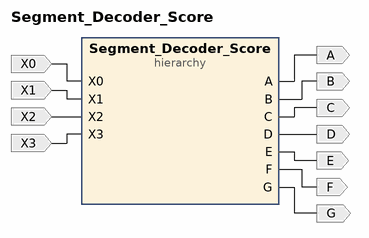
[diagram p0: block diagram of the top level]
# Vivado block design Segment_Decoder_Score, xc7a35tcpg236-1, Vivado 2018.3
create_bd_design Segment_Decoder_Score

create_bd_port -dir I X0
create_bd_port -dir I X1
create_bd_port -dir I X2
create_bd_port -dir I X3
create_bd_port -dir O A
create_bd_port -dir O B
create_bd_port -dir O C
create_bd_port -dir O D
create_bd_port -dir O E
create_bd_port -dir O F
create_bd_port -dir O G

create_bd_cell -type hier Segment_Decoder_Score

# ---- hierarchy /Segment_Decoder_Score ----
current_bd_instance /Segment_Decoder_Score
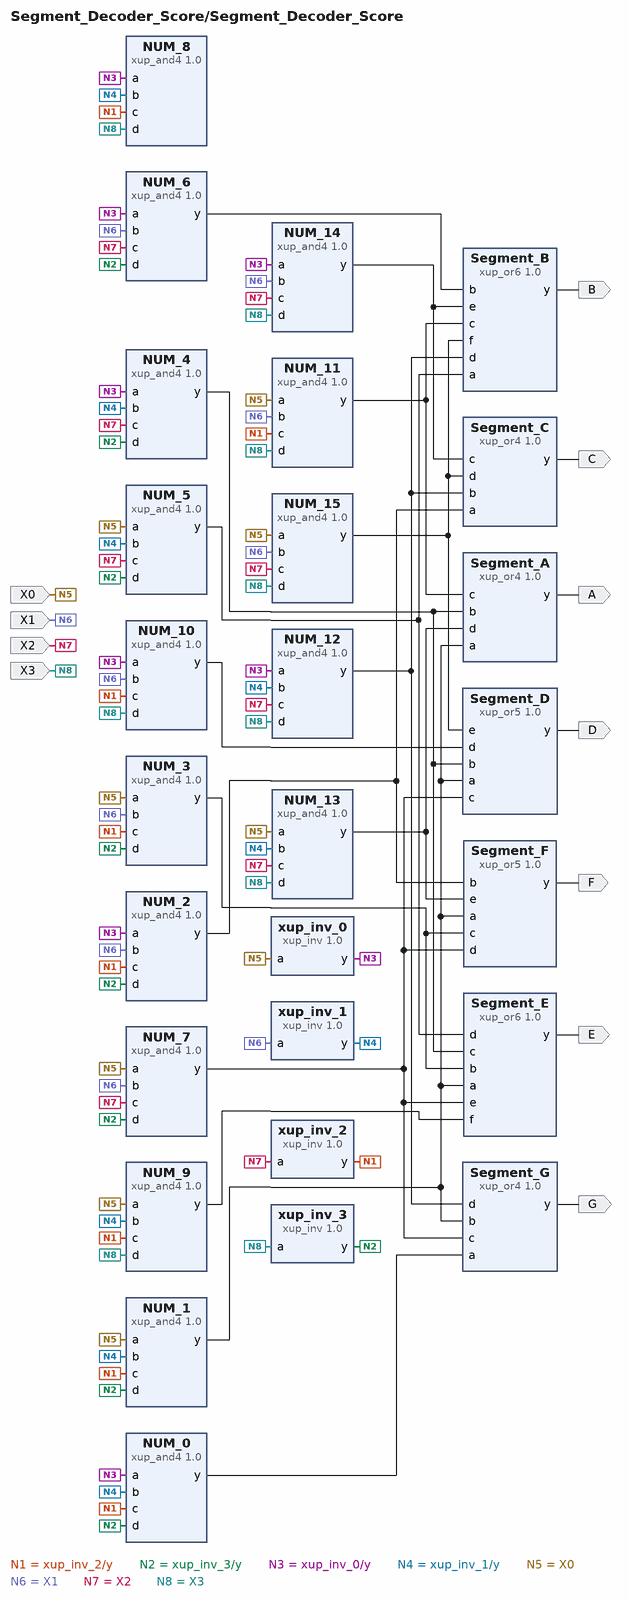
[diagram p1: block diagram inside /Segment_Decoder_Score]
create_bd_pin -dir I X0
create_bd_pin -dir I X1
create_bd_pin -dir I X2
create_bd_pin -dir I X3
create_bd_pin -dir O A
create_bd_pin -dir O B
create_bd_pin -dir O C
create_bd_pin -dir O D
create_bd_pin -dir O E
create_bd_pin -dir O F
create_bd_pin -dir O G

create_bd_cell -type ip -vlnv xilinx.com:xup:xup_and4:1.0 NUM_3
set_property -dict {CONFIG.DELAY 0} [get_bd_cells NUM_3]
create_bd_cell -type ip -vlnv xilinx.com:xup:xup_and4:1.0 NUM_4
set_property -dict {CONFIG.DELAY 0} [get_bd_cells NUM_4]
create_bd_cell -type ip -vlnv xilinx.com:xup:xup_and4:1.0 NUM_5
set_property -dict {CONFIG.DELAY 0} [get_bd_cells NUM_5]
create_bd_cell -type ip -vlnv xilinx.com:xup:xup_and4:1.0 NUM_6
set_property -dict {CONFIG.DELAY 0} [get_bd_cells NUM_6]
create_bd_cell -type ip -vlnv xilinx.com:xup:xup_and4:1.0 NUM_7
set_property -dict {CONFIG.DELAY 0} [get_bd_cells NUM_7]
create_bd_cell -type ip -vlnv xilinx.com:xup:xup_and4:1.0 NUM_10
set_property -dict {CONFIG.DELAY 0} [get_bd_cells NUM_10]
create_bd_cell -type ip -vlnv xilinx.com:xup:xup_and4:1.0 NUM_8
set_property -dict {CONFIG.DELAY 0} [get_bd_cells NUM_8]
create_bd_cell -type ip -vlnv xilinx.com:xup:xup_and4:1.0 NUM_11
set_property -dict {CONFIG.DELAY 0} [get_bd_cells NUM_11]
create_bd_cell -type ip -vlnv xilinx.com:xup:xup_and4:1.0 NUM_9
set_property -dict {CONFIG.DELAY 0} [get_bd_cells NUM_9]
create_bd_cell -type ip -vlnv xilinx.com:xup:xup_and4:1.0 NUM_12
set_property -dict {CONFIG.DELAY 0} [get_bd_cells NUM_12]
create_bd_cell -type ip -vlnv xilinx.com:xup:xup_inv:1.0 xup_inv_0
set_property -dict {CONFIG.DELAY 0} [get_bd_cells xup_inv_0]
create_bd_cell -type ip -vlnv xilinx.com:xup:xup_or4:1.0 Segment_A
set_property -dict {CONFIG.DELAY 0} [get_bd_cells Segment_A]
create_bd_cell -type ip -vlnv xilinx.com:xup:xup_and4:1.0 NUM_13
set_property -dict {CONFIG.DELAY 0} [get_bd_cells NUM_13]
create_bd_cell -type ip -vlnv xilinx.com:xup:xup_inv:1.0 xup_inv_1
set_property -dict {CONFIG.DELAY 0} [get_bd_cells xup_inv_1]
create_bd_cell -type ip -vlnv xilinx.com:xup:xup_or6:1.0 Segment_B
set_property -dict {CONFIG.DELAY 0} [get_bd_cells Segment_B]
create_bd_cell -type ip -vlnv xilinx.com:xup:xup_and4:1.0 NUM_14
set_property -dict {CONFIG.DELAY 0} [get_bd_cells NUM_14]
create_bd_cell -type ip -vlnv xilinx.com:xup:xup_inv:1.0 xup_inv_2
set_property -dict {CONFIG.DELAY 0} [get_bd_cells xup_inv_2]
create_bd_cell -type ip -vlnv xilinx.com:xup:xup_or4:1.0 Segment_C
set_property -dict {CONFIG.DELAY 0} [get_bd_cells Segment_C]
create_bd_cell -type ip -vlnv xilinx.com:xup:xup_and4:1.0 NUM_15
set_property -dict {CONFIG.DELAY 0} [get_bd_cells NUM_15]
create_bd_cell -type ip -vlnv xilinx.com:xup:xup_inv:1.0 xup_inv_3
set_property -dict {CONFIG.DELAY 0} [get_bd_cells xup_inv_3]
create_bd_cell -type ip -vlnv xilinx.com:xup:xup_or5:1.0 Segment_D
set_property -dict {CONFIG.DELAY 0} [get_bd_cells Segment_D]
create_bd_cell -type ip -vlnv xilinx.com:xup:xup_and4:1.0 NUM_0
set_property -dict {CONFIG.DELAY 0} [get_bd_cells NUM_0]
create_bd_cell -type ip -vlnv xilinx.com:xup:xup_or6:1.0 Segment_E
set_property -dict {CONFIG.DELAY 0} [get_bd_cells Segment_E]
create_bd_cell -type ip -vlnv xilinx.com:xup:xup_or5:1.0 Segment_F
set_property -dict {CONFIG.DELAY 0} [get_bd_cells Segment_F]
create_bd_cell -type ip -vlnv xilinx.com:xup:xup_and4:1.0 NUM_1
set_property -dict {CONFIG.DELAY 0} [get_bd_cells NUM_1]
create_bd_cell -type ip -vlnv xilinx.com:xup:xup_or4:1.0 Segment_G
set_property -dict {CONFIG.DELAY 0} [get_bd_cells Segment_G]
create_bd_cell -type ip -vlnv xilinx.com:xup:xup_and4:1.0 NUM_2
set_property -dict {CONFIG.DELAY 0} [get_bd_cells NUM_2]

# ---- connections ----

current_bd_instance /Segment_Decoder_Score
connect_bd_net [get_bd_pins xup_inv_2/y] \
  [get_bd_pins NUM_0/c] [get_bd_pins NUM_1/c] [get_bd_pins NUM_2/c] [get_bd_pins NUM_3/c] [get_bd_pins NUM_8/c] \
  [get_bd_pins NUM_9/c] [get_bd_pins NUM_10/c] [get_bd_pins NUM_11/c]
connect_bd_net [get_bd_pins xup_inv_3/y] \
  [get_bd_pins NUM_0/d] [get_bd_pins NUM_1/d] [get_bd_pins NUM_2/d] [get_bd_pins NUM_3/d] [get_bd_pins NUM_4/d] \
  [get_bd_pins NUM_5/d] [get_bd_pins NUM_6/d] [get_bd_pins NUM_7/d]
connect_bd_net [get_bd_pins NUM_3/y] [get_bd_pins Segment_E/b] [get_bd_pins Segment_F/c]
connect_bd_net [get_bd_pins xup_inv_0/y] \
  [get_bd_pins NUM_0/a] [get_bd_pins NUM_2/a] [get_bd_pins NUM_4/a] [get_bd_pins NUM_6/a] [get_bd_pins NUM_8/a] \
  [get_bd_pins NUM_10/a] [get_bd_pins NUM_12/a] [get_bd_pins NUM_14/a]
connect_bd_net [get_bd_pins xup_inv_1/y] \
  [get_bd_pins NUM_0/b] [get_bd_pins NUM_1/b] [get_bd_pins NUM_4/b] [get_bd_pins NUM_5/b] [get_bd_pins NUM_8/b] \
  [get_bd_pins NUM_9/b] [get_bd_pins NUM_12/b] [get_bd_pins NUM_13/b]
connect_bd_net [get_bd_pins NUM_4/y] [get_bd_pins Segment_A/b] [get_bd_pins Segment_D/b] [get_bd_pins Segment_E/c]
connect_bd_net [get_bd_pins NUM_5/y] [get_bd_pins Segment_B/a] [get_bd_pins Segment_E/d]
connect_bd_net [get_bd_pins NUM_6/y] [get_bd_pins Segment_B/b]
connect_bd_net [get_bd_pins NUM_7/y] [get_bd_pins Segment_D/c] [get_bd_pins Segment_E/e] [get_bd_pins Segment_F/d] [get_bd_pins Segment_G/c]
connect_bd_net [get_bd_pins NUM_10/y] [get_bd_pins Segment_D/d]
connect_bd_net [get_bd_pins NUM_11/y] [get_bd_pins Segment_A/c] [get_bd_pins Segment_B/c]
connect_bd_net [get_bd_pins NUM_9/y] [get_bd_pins Segment_E/f]
connect_bd_net [get_bd_pins NUM_12/y] [get_bd_pins Segment_B/d] [get_bd_pins Segment_C/b] [get_bd_pins Segment_G/d]
connect_bd_net [get_bd_pins NUM_1/y] \
  [get_bd_pins Segment_A/a] [get_bd_pins Segment_D/a] [get_bd_pins Segment_E/a] [get_bd_pins Segment_F/a] \
  [get_bd_pins Segment_G/b]
connect_bd_net [get_bd_pins NUM_13/y] [get_bd_pins Segment_A/d] [get_bd_pins Segment_F/e]
connect_bd_net [get_bd_pins NUM_14/y] [get_bd_pins Segment_B/e] [get_bd_pins Segment_C/c]
connect_bd_net [get_bd_pins NUM_15/y] [get_bd_pins Segment_B/f] [get_bd_pins Segment_C/d] [get_bd_pins Segment_D/e]
connect_bd_net [get_bd_pins NUM_2/y] [get_bd_pins Segment_C/a] [get_bd_pins Segment_F/b]
connect_bd_net [get_bd_pins NUM_0/y] [get_bd_pins Segment_G/a]
connect_bd_net -net X0_1 [get_bd_pins X0] \
  [get_bd_pins xup_inv_0/a] [get_bd_pins NUM_1/a] [get_bd_pins NUM_5/a] [get_bd_pins NUM_7/a] [get_bd_pins NUM_9/a] \
  [get_bd_pins NUM_11/a] [get_bd_pins NUM_13/a] [get_bd_pins NUM_15/a] [get_bd_pins NUM_3/a]
connect_bd_net -net X1_1 [get_bd_pins X1] \
  [get_bd_pins xup_inv_1/a] [get_bd_pins NUM_2/b] [get_bd_pins NUM_6/b] [get_bd_pins NUM_7/b] [get_bd_pins NUM_10/b] \
  [get_bd_pins NUM_11/b] [get_bd_pins NUM_14/b] [get_bd_pins NUM_15/b] [get_bd_pins NUM_3/b]
connect_bd_net -net X2_1 [get_bd_pins X2] \
  [get_bd_pins xup_inv_2/a] [get_bd_pins NUM_5/c] [get_bd_pins NUM_6/c] [get_bd_pins NUM_7/c] [get_bd_pins NUM_12/c] \
  [get_bd_pins NUM_13/c] [get_bd_pins NUM_14/c] [get_bd_pins NUM_15/c] [get_bd_pins NUM_4/c]
connect_bd_net -net X3_1 [get_bd_pins X3] \
  [get_bd_pins xup_inv_3/a] [get_bd_pins NUM_8/d] [get_bd_pins NUM_9/d] [get_bd_pins NUM_11/d] [get_bd_pins NUM_12/d] \
  [get_bd_pins NUM_13/d] [get_bd_pins NUM_14/d] [get_bd_pins NUM_15/d] [get_bd_pins NUM_10/d]
connect_bd_net -net xup_or4_0_y [get_bd_pins Segment_A/y] [get_bd_pins A]
connect_bd_net -net xup_or6_0_y [get_bd_pins Segment_B/y] [get_bd_pins B]
connect_bd_net -net xup_or4_1_y [get_bd_pins Segment_C/y] [get_bd_pins C]
connect_bd_net -net xup_or5_0_y [get_bd_pins Segment_D/y] [get_bd_pins D]
connect_bd_net -net xup_or6_1_y [get_bd_pins Segment_E/y] [get_bd_pins E]
connect_bd_net -net xup_or5_1_y [get_bd_pins Segment_F/y] [get_bd_pins F]
connect_bd_net -net xup_or4_2_y [get_bd_pins Segment_G/y] [get_bd_pins G]

current_bd_instance /
connect_bd_net -net X0_1 [get_bd_ports X0] [get_bd_pins Segment_Decoder_Score/X0]
connect_bd_net -net X1_1 [get_bd_ports X1] [get_bd_pins Segment_Decoder_Score/X1]
connect_bd_net -net X2_1 [get_bd_ports X2] [get_bd_pins Segment_Decoder_Score/X2]
connect_bd_net -net X3_1 [get_bd_ports X3] [get_bd_pins Segment_Decoder_Score/X3]
connect_bd_net -net xup_or4_0_y [get_bd_pins Segment_Decoder_Score/A] [get_bd_ports A]
connect_bd_net -net xup_or6_0_y [get_bd_pins Segment_Decoder_Score/B] [get_bd_ports B]
connect_bd_net -net xup_or4_1_y [get_bd_pins Segment_Decoder_Score/C] [get_bd_ports C]
connect_bd_net -net xup_or5_0_y [get_bd_pins Segment_Decoder_Score/D] [get_bd_ports D]
connect_bd_net -net xup_or6_1_y [get_bd_pins Segment_Decoder_Score/E] [get_bd_ports E]
connect_bd_net -net xup_or5_1_y [get_bd_pins Segment_Decoder_Score/F] [get_bd_ports F]
connect_bd_net -net xup_or4_2_y [get_bd_pins Segment_Decoder_Score/G] [get_bd_ports G]

validate_bd_design
save_bd_design
